# Altium schematic sheet USB.SchDoc
size A4; SheetNumber: 3; SheetTotal: 3
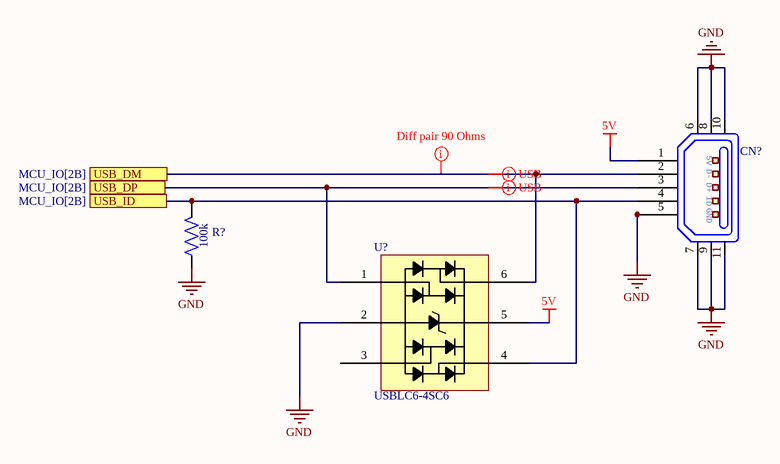
[diagram p0: USB.SchDoc]

## Parts
CN?  MUSB-05-F-AB-SM-A-K  [USB]  (value not drawn)
R?  RC0402JR-07100KL  [R0402]  (value not drawn)
U?  USBLC6-4SC6  [SOT23-6]

## Ports
USB_DM (see MCU_IO[2B]), USB_DP (see MCU_IO[2B]), USB_ID (see MCU_IO[2B])

## Nets
5V: CN?.1 U?.5
GND: CN?.5 CN?.6 CN?.7 CN?.8 CN?.9 CN?.10 CN?.11 R?.1 U?.2(GND)
USB_DM: CN?.2 U?.6 ; port USB_DM
USB_DP: CN?.3 U?.1 ; port USB_DP
USB_ID: CN?.4 R?.2 U?.4 ; port USB_ID

Not connected (* = marked no-connect by the designer): U? 3

## Layout directives
mark named Diff pair 90 Ohms: USB_DM
differential pair: USB_DM, USB_DP

## Notes on the sheet
- (in symbol MUSB-05-F-AB-SM-A-K) 5V; D-; D+; ID; GND
- (in symbol RC0402JR-07100KL) 100k

## Library data of the parts
CN? = MUSB-05-F-AB-SM-A-K: "Mini USB 2.0 Interface"; Manufacturer: Samtec; Supplier: Digikey; Supplier Part Number: 612-MUSB-05-F-AB-SM-A-K-ND; Manufacturer Part Number: MUSB-05-F-AB-SM-A-K; RoHS: No; Category: Connectors; Pricing: 1=1,56 (USD); RoHS Compliant: No; ComponentLink1URL: https://datasheet.octopart.com/MUSB-05-F-AB-SM-A-K-Samtec-datasheet-151555050.pdf?src-supplier=Sager+Electronics; ComponentLink1Description: https://datasheet.octopart.com/MUSB-05-F-AB-SM-A-K-Samtec-datasheet-151555050.pdf?src-supplier=Sager+Electronics; ComponentLink2URL: https://datasheet.octopart.com/MUSB-05-F-AB-SM-A-K-Samtec-datasheet-97180724.pdf?src-supplier=Samtec; ComponentLink2Description: https://datasheet.octopart.com/MUSB-05-F-AB-SM-A-K-Samtec-datasheet-97180724.pdf?src-supplier=Samtec; ComponentLink3URL: https://datasheet.octopart.com/MUSB-05-F-AB-SM-A-K-Samtec-datasheet-129014306.pdf?src-supplier=Electro+Sonic; ComponentLink3Description: https://datasheet.octopart.com/MUSB-05-F-AB-SM-A-K-Samtec-datasheet-129014306.pdf?src-supplier=Electro+Sonic
R? = RC0402JR-07100KL: SMD Chip Resistor, 100 Kohm, ½ 5%, 62.5 Mw, 0402 [1005 Metric], Thick Film, General Purpose; Manufacturer: Yageo; Voltage Rating: 50V; Value: 100kR; Power Rating: 62.5mW; Temperature Coefficient: 100ppm/°C; Max Power Dissipation: 63mW; Supplier: Future Electronics; Supplier Part Number: 4246625; Manufacturer Part Number: RC0402JR-07100KL; RoHS: Yes; Category: Chip SMD Resistors; Stock: 7850000; Pricing: 10000=0,0006, 50000=0,0006, 250000=0,0005, 500000=0,0005, 1500000=0,0005 (USD); Case/Package: 0402; Case Code (Metric): 1005; Case Code (Imperial): 0402; Min Operating Temperature: -55°C; Max Operating Temperature: 155°C; Packaging: Tape and Reel; Termination: SMD/SMT; Voltage Rating (AC): 50V; Tolerance: 5%; Resistor Type: Thick Film; Number of Terminations: 2; Features: Moisture Resistant; Series: RC; Resistance Tolerance: 5%; Construction: Rectangular; Length: 1mm; Depth: 0.5mm; Lead Free: Lead Free; Reach SVHC Compliant: Unknown; Military Standard: Not; RoHS Compliant: Yes; ComponentLink1URL: https://datasheet.ciiva.com/2491/pyu-r-int-thick-7-2491208.pdf?src-supplier=Digikey; ComponentLink1Description: https://datasheet.ciiva.com/2491/pyu-r-int-thick-7-2491208.pdf?src-supplier=Digikey; ComponentLink2URL: https://datasheet.ciiva.com/2491/pyu-r-int-thick-7-2491209.pdf?src-supplier=Digikey; ComponentLink2Description: https://datasheet.ciiva.com/2491/pyu-r-int-thick-7-2491209.pdf?src-supplier=Digikey; ComponentLink3URL: https://datasheet.ciiva.com/2491/pyu-r-int-thick-7-2491207.pdf?src-supplier=Digikey; ComponentLink3Description: https://datasheet.ciiva.com/2491/pyu-r-int-thick-7-2491207.pdf?src-supplier=Digikey; ComponentLink4URL: https://datasheet.ciiva.com/17052/pyu-rc0402-51-rohs-l-6-r-17052137.pdf?src-supplier=Future+Electronics; ComponentLink4Description: https://datasheet.ciiva.com/17052/pyu-rc0402-51-rohs-l-6-r-17052137.pdf?src-supplier=Future+Electronics; ComponentLink5URL: https://datasheet.ciiva.com/46394/1018594-46394941.pdf?src-supplier=Element14; ComponentLink5Description: https://datasheet.ciiva.com/46394/1018594-46394941.pdf?src-supplier=Element14; ComponentLink6URL: https://datasheet.ciiva.com/7850/1018594-7850133.pdf?src-supplier=Element14; ComponentLink6Description: https://datasheet.ciiva.com/7850/1018594-7850133.pdf?src-supplier=Element14; ComponentLink7URL: https://datasheet.ciiva.com/12668/pyu-rc0402-51-rohs-l-6-r-12668218.pdf?src-supplier=Mouser; ComponentLink7Description: https://datasheet.ciiva.com/12668/pyu-rc0402-51-rohs-l-6-r-12668218.pdf?src-supplier=Mouser
U? = USBLC6-4SC6: USBLC6 Series 4 Line 6 V Uni / Bi-Directional ESD Protection - SOT-23-6; Manufacturer: STMicroelectronics; Value: 4pF; Direction: Unidirectional; Number of Channels: 4; Reverse Standoff Voltage: 5V; Min Breakdown Voltage: 6V; Power Line Protection: Yes; Peak Pulse Current: 5A; Number of Elements: 1; Operating Supply Voltage: 860mV; Clamping Voltage: 17V; Polarity: Unidirectional,Bidirectional; Leakage Current: 150nA; Test Current: 1mA; Max Breakdown Voltage: 10V; Max Reverse Leakage Current: 2uA; Interface: 224,1515Interface; Peak Pulse Power: 130W; Supplier: Future Electronics; Supplier Part Number: 5949821; Manufacturer Part Number: USBLC6-4SC6; RoHS: Yes; Category: TVS Diodes; Stock: 1416000; Pricing: 3000=0,0692, 9000=0,0666, 15000=0,0654, 30000=0,0638, 60000=0,0614 (USD); Mounting Technology: Surface Mount; Case/Package: SOT-23; Pins: 6; Min Operating Temperature: -40°C; Max Operating Temperature: 125°C; Packaging: Tape and Reel; Breakdown Voltage: 6V; Series: USB; Reverse Breakdown Voltage: 6V; Termination: SMD/SMT; Working Voltage: 5V; ESD Protection: Yes; Voltage Rating (DC): 5V; Clamping Voltage-Max: 17V; Number of Unidirectional Channels: 4; Length: 3.05mm; Width: 1.75mm; Height: 1.3mm; Depth: 1.75mm; Radiation Hardening: No; Reach SVHC Compliant: No; Lead Free: Lead Free; RoHS Compliant: Yes; ComponentLink1URL: https://datasheet.ciiva.com/16206/cd00047494-16206119.pdf?src-supplier=Future+Electronics; ComponentLink1Description: https://datasheet.ciiva.com/16206/cd00047494-16206119.pdf?src-supplier=Future+Electronics; ComponentLink2URL: https://datasheet.ciiva.com/15143/getdatasheetpartid-88767-15143364.pdf?src-supplier=Verical; ComponentLink2Description: https://datasheet.ciiva.com/15143/getdatasheetpartid-88767-15143364.pdf?src-supplier=Verical; ComponentLink3URL: https://datasheet.ciiva.com/27052/1493951-27052291.pdf?src-supplier=Jameco; ComponentLink3Description: https://datasheet.ciiva.com/27052/1493951-27052291.pdf?src-supplier=Jameco; ComponentLink4URL: https://datasheet.ciiva.com/14186/usblc6-4-st-eng-tds-14186570.pdf?src-supplier=Distrelec; ComponentLink4Description: https://datasheet.ciiva.com/14186/usblc6-4-st-eng-tds-14186570.pdf?src-supplier=Distrelec; ComponentLink5URL: https://datasheet.ciiva.com/1220/48344-1220005.pdf?src-supplier=Newark; ComponentLink5Description: https://datasheet.ciiva.com/1220/48344-1220005.pdf?src-supplier=Newark; ComponentLink6URL: https://datasheet.ciiva.com/4507/cd00047494-112581-4507757.pdf?src-supplier=Mouser; ComponentLink6Description: https://datasheet.ciiva.com/4507/cd00047494-112581-4507757.pdf?src-supplier=Mouser; ComponentLink7URL: https://datasheet.ciiva.com/22685/1498406-22685833.pdf?src-supplier=Element14; ComponentLink7Description: https://datasheet.ciiva.com/22685/1498406-22685833.pdf?src-supplier=Element14; ComponentLink8URL: https://datasheet.ciiva.com/22692/1498406-22692454.pdf?src-supplier=Element14; ComponentLink8Description: https://datasheet.ciiva.com/22692/1498406-22692454.pdf?src-supplier=Element14